# Altium schematic sheet MainBoard_ETH_RASP.SchDoc
size 594 x 420 mm; DocumentNumber: VSL.23-MOTHERBOARD; SheetNumber: 4; Format: A2
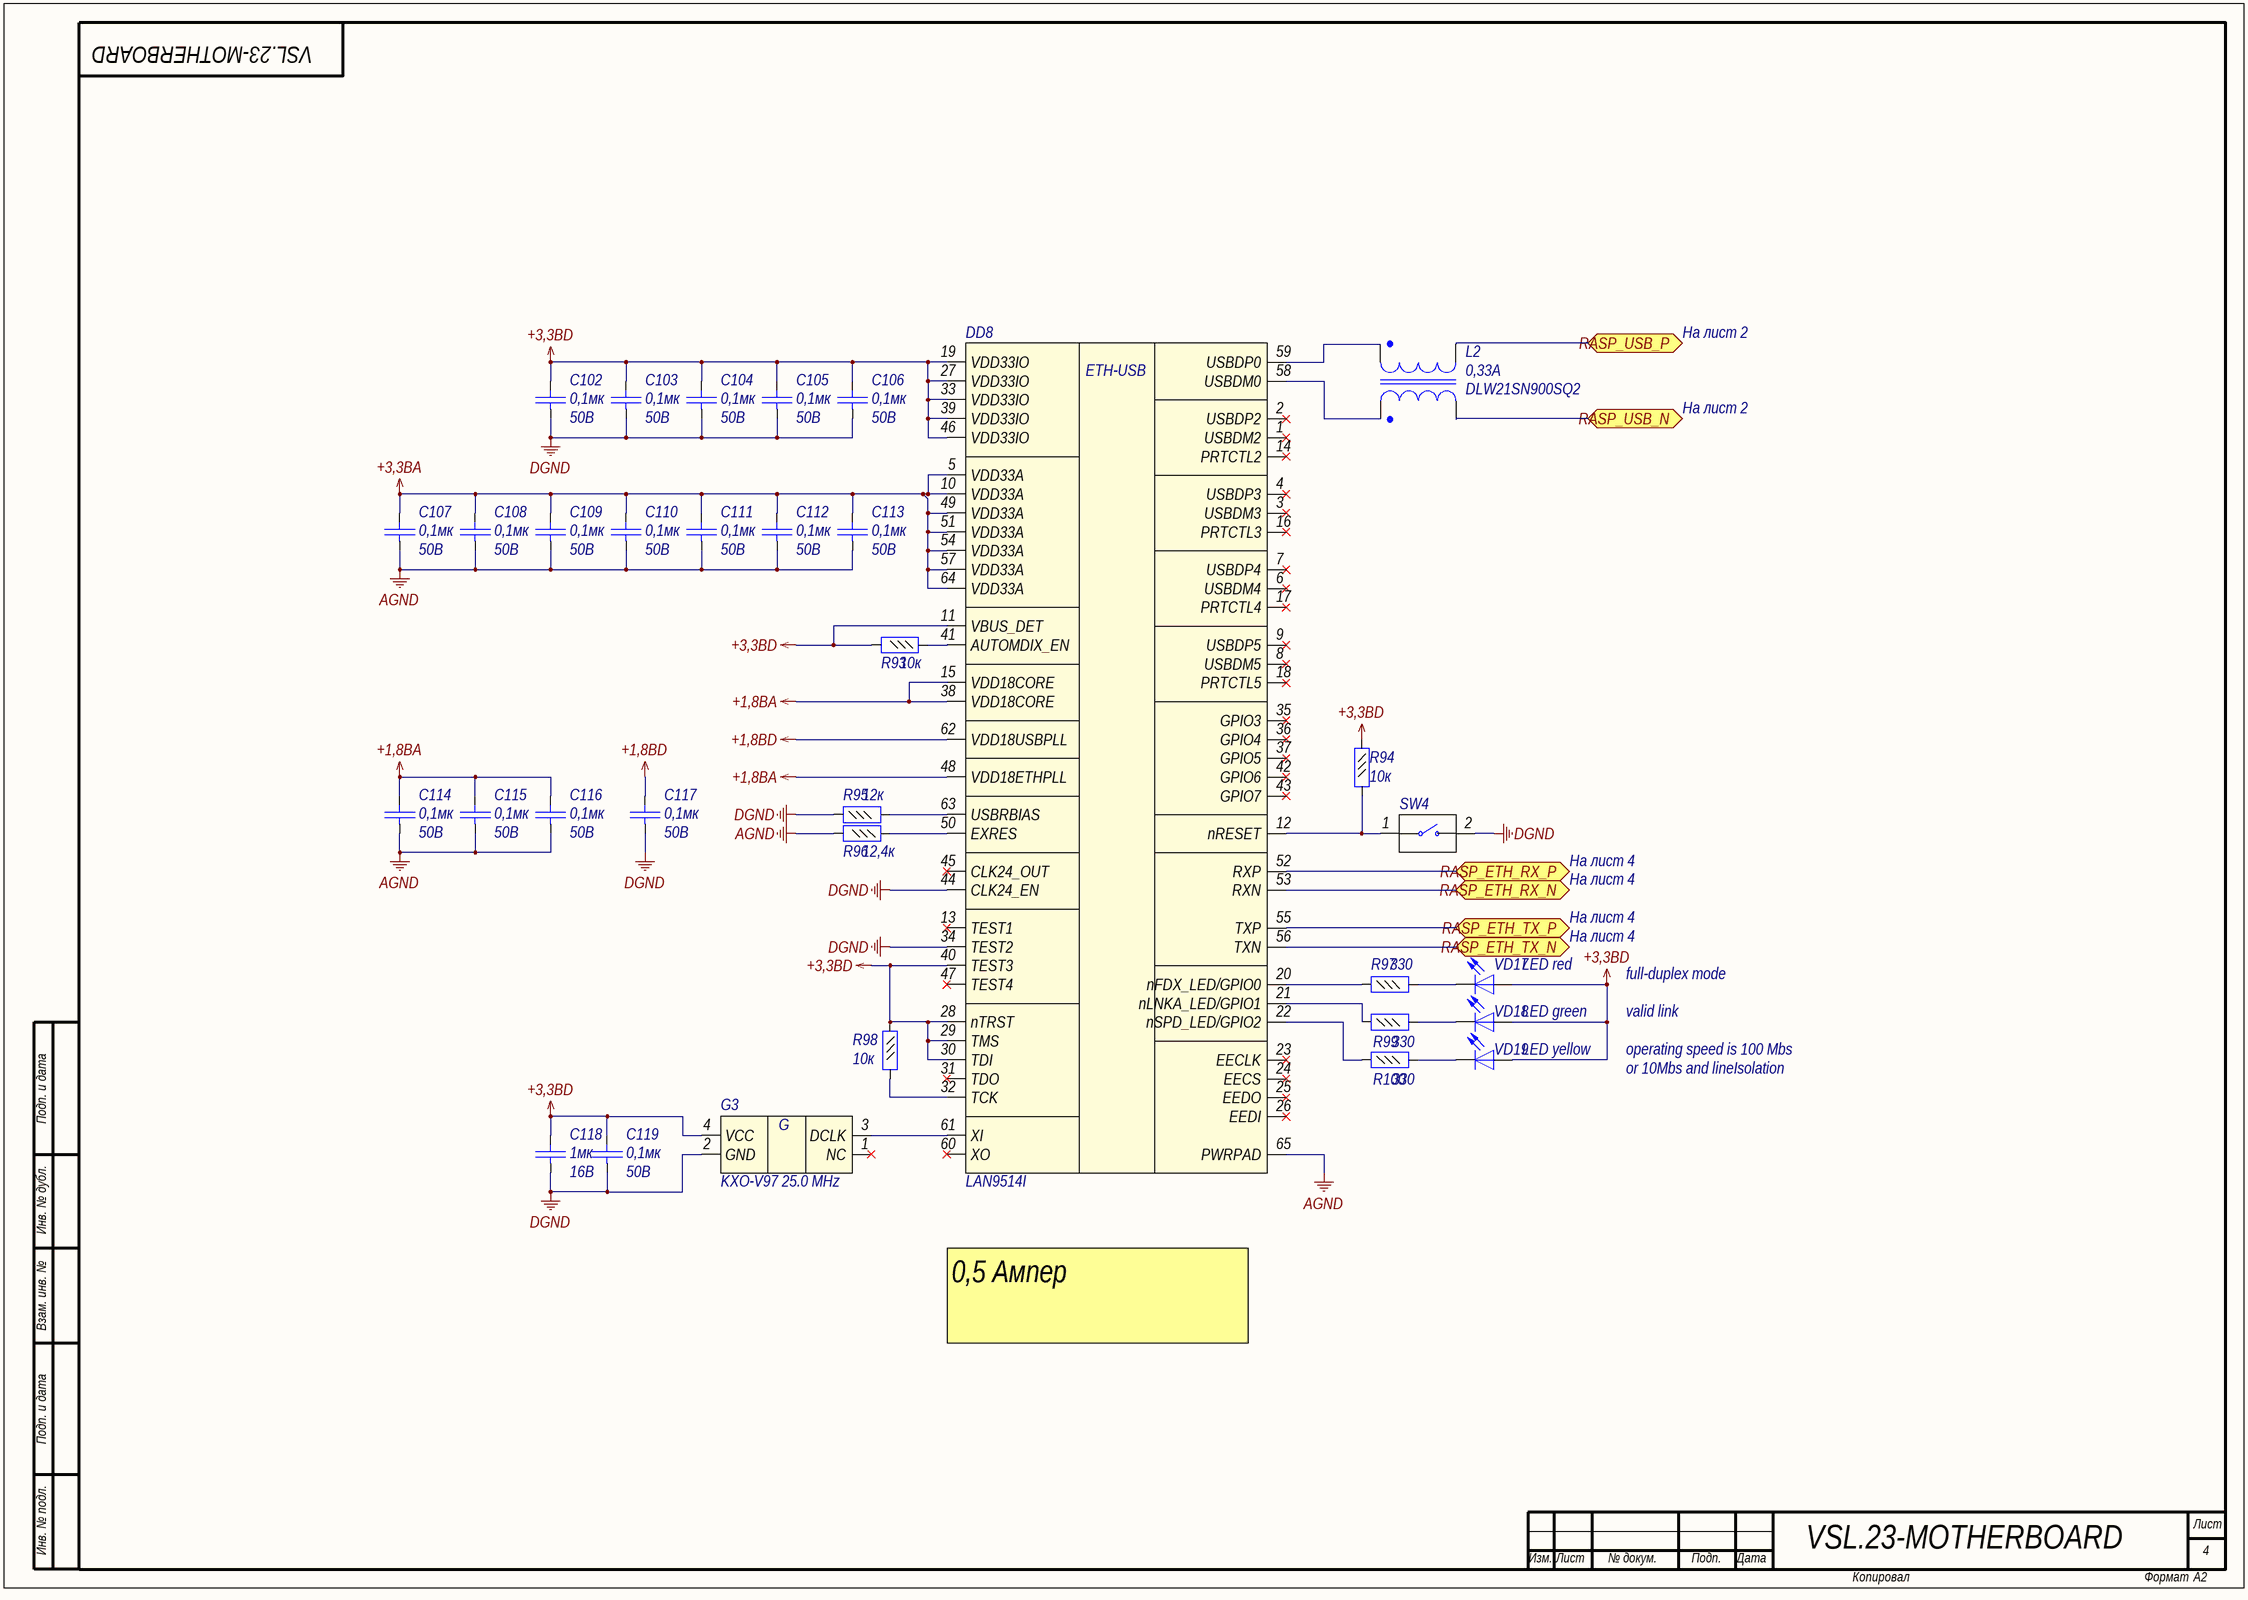
[diagram p0: MainBoard_ETH_RASP.SchDoc]

## Parts
C102  value 0,1мк  Voltage: 50В  [C0402]  (hidden comment: Capacitor)
C103  value 0,1мк  Voltage: 50В  [C0402]  (hidden comment: Capacitor)
C104  value 0,1мк  Voltage: 50В  [C0402]  (hidden comment: Capacitor)
C105  value 0,1мк  Voltage: 50В  [C0402]  (hidden comment: Capacitor)
C106  value 0,1мк  Voltage: 50В  [C0402]  (hidden comment: Capacitor)
C107  value 0,1мк  Voltage: 50В  [C0402]  (hidden comment: Capacitor)
C108  value 0,1мк  Voltage: 50В  [C0402]  (hidden comment: Capacitor)
C109  value 0,1мк  Voltage: 50В  [C0402]  (hidden comment: Capacitor)
C110  value 0,1мк  Voltage: 50В  [C0402]  (hidden comment: Capacitor)
C111  value 0,1мк  Voltage: 50В  [C0402]  (hidden comment: Capacitor)
C112  value 0,1мк  Voltage: 50В  [C0402]  (hidden comment: Capacitor)
C113  value 0,1мк  Voltage: 50В  [C0402]  (hidden comment: Capacitor)
C114  value 0,1мк  Voltage: 50В  [C0402]  (hidden comment: Capacitor)
C115  value 0,1мк  Voltage: 50В  [C0402]  (hidden comment: Capacitor)
C116  value 0,1мк  Voltage: 50В  [C0402]  (hidden comment: Capacitor)
C117  value 0,1мк  Voltage: 50В  [C0402]  (hidden comment: Capacitor)
C118  value 1мк  Voltage: 16B  [C0603]  (hidden comment: Capacitor)
C119  value 0,1мк  Voltage: 50В  [C0402]  (hidden comment: Capacitor)
DD8  (no value)  [QFN64]
G3  Part Number: KXO-V97 25.0 MHz  [QSMD7x5.2x1.8]  (hidden comment: KXO)
L2  Rated Current: 0,33A  Part Number: DLW21SN900SQ2  [CHOKE0805]  (hidden comment: Dual-Winding Inductor)
R93  value 10к  [R0402]  (hidden comment: Resistor_0,062Вт)
R94  value 10к  [R0402]  (hidden comment: Resistor_0,062Вт)
R95  value 12к  [R0402]  (hidden comment: Resistor_0,062Вт)
R96  value 12,4к  [R0402]  (hidden comment: Resistor_0,062Вт)
R97  value 330  [R0402]  (hidden comment: Resistor_0,062Вт)
R98  value 10к  [R0402]  (hidden comment: Resistor_0,062Вт)
R99  value 330  [R0402]  (hidden comment: Resistor_0,062Вт)
R100  value 330  [R0402]  (hidden comment: Resistor_0,062Вт)
SW4  DS1040-01  [JUMPER_2.54]  (value not drawn)
VD17  Part Name: LED red  [L_0402_RED]  (hidden comment: LED)
VD18  Part Name: LED green  [L_0402_GREEN]  (hidden comment: LED)
VD19  Part Name: LED yellow  [L_0402_YELLOW]  (hidden comment: LED)

## Ports
RASP_ETH_RX_N, RASP_ETH_RX_P, RASP_ETH_TX_N, RASP_ETH_TX_P, RASP_USB_N, RASP_USB_P

## Nets
+1,8BA: C114.2 C115.2 C116.2 DD8.15(VDD18CORE) DD8.38(VDD18CORE) DD8.48(VDD18ETHPLL)
+1,8BD: C117.2 DD8.62(VDD18USBPLL)
+3,3BA: C107.2 C108.2 C109.2 C110.2 C111.2 C112.2 C113.2 DD8.5(VDD33A) DD8.10(VDD33A) DD8.49(VDD33A) DD8.51(VDD33A) DD8.54(VDD33A) DD8.57(VDD33A) DD8.64(VDD33A)
+3,3BD: C102.2 C103.2 C104.2 C105.2 C106.2 C118.2 C119.2 DD8.11(VBUS_DET) DD8.19(VDD33IO) DD8.27(VDD33IO) DD8.28(nTRST) DD8.29(TMS) DD8.30(TDI) DD8.33(VDD33IO) DD8.39(VDD33IO) DD8.40(TEST3) DD8.46(VDD33IO) G3.4(VCC) R93.2 R94.1 R98.1 VD17.2(A) VD18.2(A) VD19.2(A)
AGND: C107.1 C108.1 C109.1 C110.1 C111.1 C112.1 C113.1 C114.1 C115.1 C116.1 DD8.65(PWRPAD) R96.2
DGND: C102.1 C103.1 C104.1 C105.1 C106.1 C117.1 C118.1 C119.1 DD8.34(TEST2) DD8.44(CLK24_EN) G3.2(GND) R95.1 SW4.2
RASP_ETH_RX_N: DD8.53(RXN) ; port RASP_ETH_RX_N
RASP_ETH_RX_P: DD8.52(RXP) ; port RASP_ETH_RX_P
RASP_ETH_TX_N: DD8.56(TXN) ; port RASP_ETH_TX_N
RASP_ETH_TX_P: DD8.55(TXP) ; port RASP_ETH_TX_P
RASP_USB_N: L2.4 ; port RASP_USB_N
RASP_USB_P: L2.3 ; port RASP_USB_P
NetDD8_12: DD8.12(nRESET) R94.2 SW4.1
NetDD8_20: DD8.20(nFDX_LED/GPIO0) R97.1
NetDD8_21: DD8.21(nLNKA_LED/GPIO1) R99.1
NetDD8_22: DD8.22(nSPD_LED/GPIO2) R100.1
NetDD8_32: DD8.32(TCK) R98.2
NetDD8_41: DD8.41(AUTOMDIX_EN) R93.1
NetDD8_50: DD8.50(EXRES) R96.1
NetDD8_58: DD8.58(USBDM0) L2.2
NetDD8_59: DD8.59(USBDP0) L2.1
NetDD8_61: DD8.61(XI) G3.3(DCLK)
NetDD8_63: DD8.63(USBRBIAS) R95.2
NetR97_2: R97.2 VD17.1(K)
NetR99_2: R99.2 VD18.1(K)
NetR100_2: R100.2 VD19.1(K)

Not connected (* = marked no-connect by the designer): DD8 1(USBDM2)* 2(USBDP2)* 3(USBDM3)* 4(USBDP3)* 6(USBDM4)* 7(USBDP4)* 8(USBDM5)* 9(USBDP5)* 13(TEST1)* 14(PRTCTL2)* 16(PRTCTL3)* 17(PRTCTL4)* 18(PRTCTL5)* 23(EECLK)* 24(EECS)* 25(EEDO)* 26(EEDI)* 31(TDO)* 35(GPIO3)* 36(GPIO4)* 37(GPIO5)* 42(GPIO6)* 43(GPIO7)* 45(CLK24_OUT)* 47(TEST4)* 60(XO)*; G3 1(NC)*

## Notes on the sheet
- На лист 2
- На лист 4
- full-duplex mode
- valid link
- operating speed is 100 Mbs
- or 10Mbs and lineIsolation
- Подп. и дата
- Инв. № дубл.
- Взам. инв. №
- 0,5 Ампер
- Инв. № подл.
- Лист
- Изм.
- № докум.
- Подп.
- Дата
- Копировал
- Формат
- (in symbol crystal9) G
- (in symbol interf25) ETH-USB

## Library data of the parts
C102-C117 C119 = cap277: Конденсатор; Part Name: Ceramic; Manufacture: Murata; Part Number: GRM155R71H104KE14D; id: cap277; TKE: X7R; tga: 0,10%
C118 = cap133: Конденсатор; Part Name: Ceramic; Manufacture: Murata; Part Number: GRM188R71C105KA12D**; id: cap133; TKE: X7R
DD8 = interf25: USB 2.0 Hub and 10/100 Ethernet Controller; Manufacture: Microchip; Number of Channel: 4; Type Supply: Single Polar; Current Consumption: 288мА; Power Supply: 3,3В; id: interf25; Part Name: USB 2.0 Hub and 10/100 Ethernet Controller; Part Number: LAN9514I
G3 = crystal9: Кварц. генер. 32.768 МГц (HCMOS/TTL); Manufacture: GEYER; Frequence: 25MHz; Power Supply: 3,3B; Tempreture MIN: -20°С; Tempreture MAX: +70°С; id: crystal9
L2 = ind68: Синфазный дроссель; Part Name: Ind Common Mode Choke USB EMI; Manufacture: Murata; id: ind68; Resistance: 0,35Ohm
R93 R94 R98 = res294: Резистор; Manufacture: Yageo; Part Number: RC0402FR-0710KL; id: res294; Accuracy: 0,01; Part Name: Resistor; Power: 0,062Вт
R95 = res296: Резистор; Manufacture: Yageo; Part Number: RC0402FR-0712KL; id: res296; Accuracy: 0,01; Part Name: Resistor; Power: 0,062Вт
R96 = res979: Резистор; Manufacture: Yageo; Part Number: RC0402FR-0712K4L; id: res979; Accuracy: 0,01; Part Name: Resistor; Power: 0,062Вт
R97 R99 R100 = res258: Резистор; Manufacture: Yageo; Part Number: RC0402FR-07330RL; id: res258; Accuracy: 0,01; Part Name: Resistor; Power: 0,062Вт
SW4 = btn9: DIP переключатель; Part Name: Перемычка адреса; id: btn9; Etch: 2,54
VD17 = diode28: Светодиод; Part Number: KPHHS-1005SURCK; id: diode28
VD18 = diode30: Светодиод; Part Number: KPHHS-1005MGCK; id: diode30
VD19 = diode29: Светодиод; Part Number: KPHHS-1005SYCK; id: diode29